# EAGLE design flukso1.3 (EAGLE 5.10)
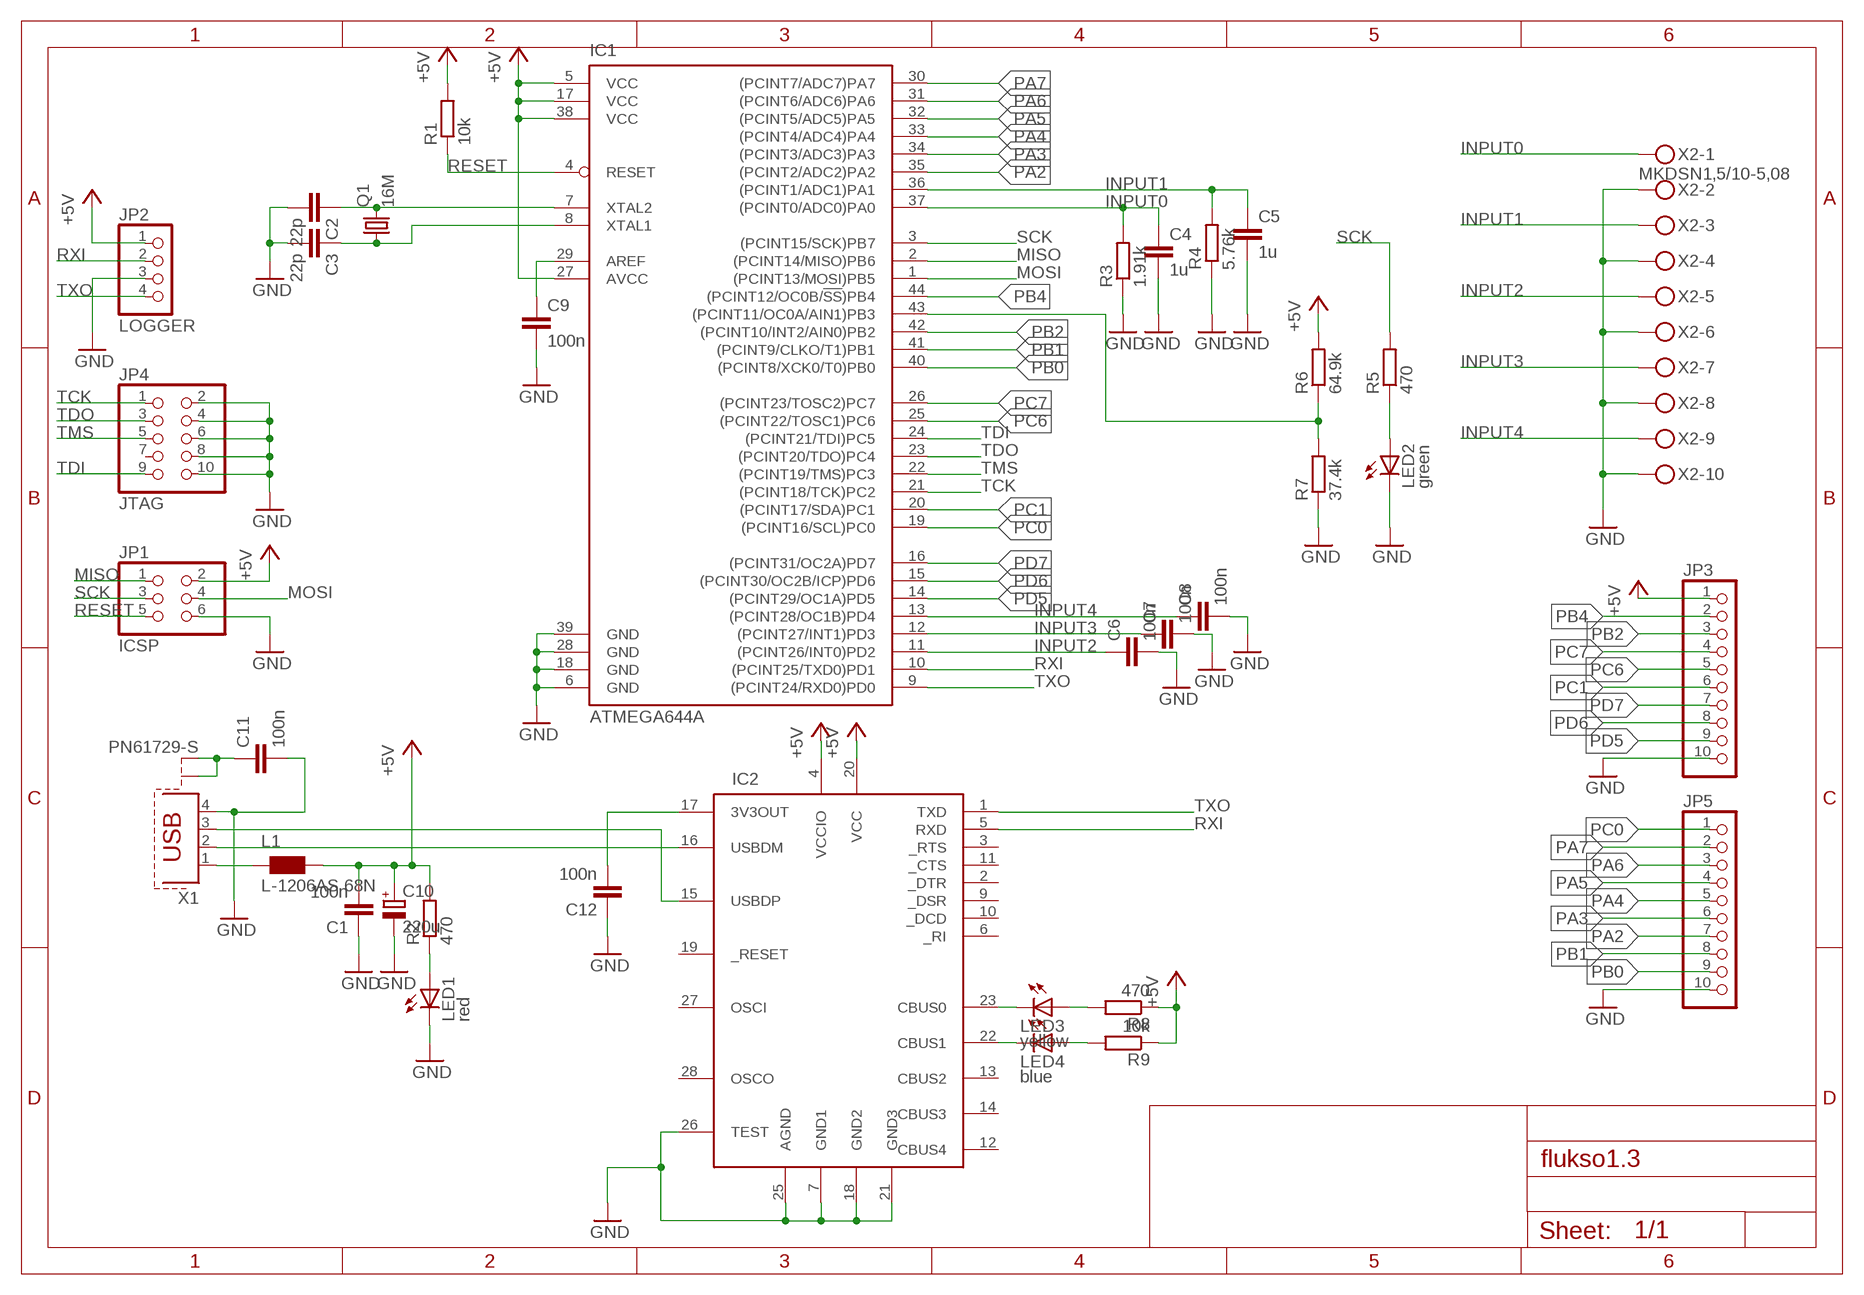
[diagram p0: schematic, sheet 1]

## Parts
C1  100n  C-EUC1206  [C1206]
C2  22p  C-EUC1206  [C1206]
C3  22p  C-EUC1206  [C1206]
C4  1u  C-EUC1206  [C1206]
C5  1u  C-EUC1206  [C1206]
C6  100n  C-EUC1206  [C1206]
C7  100n  C-EUC1206  [C1206]
C8  100n  C-EUC1206  [C1206]
C9  100n  C-EUC1206  [C1206]
C10  220u  CPOL-EU153CLV-0605  [153CLV-0605]
C11  100n  C-EUC1206  [C1206]
C12  100n  C-EUC1206  [C1206]
IC1  ATMEGA644A  [TQFP44]
IC2  FT232RL  [SSOP28DB]
JP1  ICSP  PINHD-2X3  [2X03]
JP2  LOGGER  PINHD-1X4  [1X04]
JP3  PINHD-1X10  [1X10]
JP4  JTAG  PINHD-2X5  [2X05]
JP5  PINHD-1X10  [1X10]
L1  L-1206AS 68N  WE-CBF_1206  [1206]
LED1  red  LEDSMT1206  [1206]
LED2  green  LEDSMT1206  [1206]
LED3  yellow  LEDSMT1206  [1206]
LED4  blue  LEDSMT1206  [1206]
Q1  16M  CRYSTALHC49S  [HC49/S]
R1  10k  R-EU_M1206  [M1206]
R2  470  R-EU_M1206  [M1206]
R3  1.91k  R-EU_M1206  [M1206]
R4  5.76k  R-EU_M1206  [M1206]
R5  470  R-EU_M1206  [M1206]
R6  64.9k  R-EU_M1206  [M1206]
R7  37.4k  R-EU_M1206  [M1206]
R8  470  R-EU_M1206  [M1206]
R9  10k  R-EU_M1206  [M1206]
X1  PN61729-S  [PN61729-S]
X2  MKDSN1,5/10-5,08  [MKDSN1,5/10-5,08]

## Nets
+5V: C1.2 C10.+ IC1.5(VCC) IC1.17(VCC) IC1.27(AVCC) IC1.38(VCC) IC2.4(VCCIO) IC2.20(VCC) JP1.2 JP2.1 JP3.1 L1.2 R1.2 R2.2 R6.2 R8.1 R9.1
GND: C1.1 C2.2 C3.2 C4.2 C5.2 C6.2 C7.2 C8.2 C9.2 C10.- C11.2 C12.1 IC1.6(GND) IC1.18(GND) IC1.28(GND) IC1.39(GND) IC2.7(GND1) IC2.18(GND2) IC2.21(GND3) IC2.25(AGND) IC2.26(TEST) JP1.6 JP2.3 JP3.10 JP4.2 JP4.4 JP4.6 JP4.8 JP4.10 JP5.10 LED1.C LED2.C R3.1 R4.1 R7.1 X1.4 X2.2 X2.4 X2.6 X2.8 X2.10
INPUT0: C4.1 IC1.37((PCINT0/ADC0)PA0) R3.2 X2.1
INPUT1: C5.1 IC1.36((PCINT1/ADC1)PA1) R4.2 X2.3
INPUT2: C6.1 IC1.11((PCINT26/INT0)PD2) X2.5
INPUT3: C7.1 IC1.12((PCINT27/INT1)PD3) X2.7
INPUT4: C8.1 IC1.13((PCINT28/OC1B)PD4) X2.9
MISO: IC1.2((PCINT14/MISO)PB6) JP1.1
MOSI: IC1.1((PCINT13/MOSI)PB5) JP1.4
N$1: L1.1 X1.1
N$2: C11.1 X1.S1 X1.S2
N$3: LED1.A R2.1
N$4: IC2.16(USBDM) X1.2
N$5: IC2.15(USBDP) X1.3
N$6: C12.2 IC2.17(3V3OUT)
N$7: IC1.43((PCINT11/OC0A/AIN1)PB3) R6.1 R7.2
N$8: IC2.23(CBUS0) LED3.C
N$9: LED3.A R8.2
N$10: IC2.22(CBUS1) LED4.C
N$11: LED4.A R9.2
N$12: C2.1 IC1.7(XTAL2) Q1.2
N$13: C3.1 IC1.8(XTAL1) Q1.1
N$14: C9.1 IC1.29(AREF)
N$16: LED2.A R5.1
PA2: IC1.35((PCINT2/ADC2)PA2) JP5.7
PA3: IC1.34((PCINT3/ADC3)PA3) JP5.6
PA4: IC1.33((PCINT4/ADC4)PA4) JP5.5
PA5: IC1.32((PCINT5/ADC5)PA5) JP5.4
PA6: IC1.31((PCINT6/ADC6)PA6) JP5.3
PA7: IC1.30((PCINT7/ADC7)PA7) JP5.2
PB0: IC1.40((PCINT8/XCK0/T0)PB0) JP5.9
PB1: IC1.41((PCINT9/CLKO/T1)PB1) JP5.8
PB2: IC1.42((PCINT10/INT2/AIN0)PB2) JP3.3
PB4: IC1.44((PCINT12/OC0B/!SS!)PB4) JP3.2
PC0: IC1.19((PCINT16/SCL)PC0) JP5.1
PC1: IC1.20((PCINT17/SDA)PC1) JP3.6
PC6: IC1.25((PCINT22/TOSC1)PC6) JP3.5
PC7: IC1.26((PCINT23/TOSC2)PC7) JP3.4
PD5: IC1.14((PCINT29/OC1A)PD5) JP3.9
PD6: IC1.15((PCINT30/OC2B/ICP)PD6) JP3.8
PD7: IC1.16((PCINT31/OC2A)PD7) JP3.7
RESET: IC1.4(RESET) JP1.5 R1.1
RXI: IC1.10((PCINT25/TXD0)PD1) IC2.5(RXD) JP2.2
SCK: IC1.3((PCINT15/SCK)PB7) JP1.3 R5.2
TCK: IC1.21((PCINT18/TCK)PC2) JP4.1
TDI: IC1.24((PCINT21/TDI)PC5) JP4.9
TDO: IC1.23((PCINT20/TDO)PC4) JP4.3
TMS: IC1.22((PCINT19/TMS)PC3) JP4.5
TXO: IC1.9((PCINT24/RXD0)PD0) IC2.1(TXD) JP2.4
Unconnected: IC2.2(_DTR) IC2.3(_RTS) IC2.6(_RI) IC2.9(_DSR) IC2.10(_DCD) IC2.11(_CTS) IC2.12(CBUS4) IC2.13(CBUS2) IC2.14(CBUS3) IC2.19(_RESET) IC2.27(OSCI) IC2.28(OSCO) JP4.7

## Library data of the parts
C1-C9 C11 C12 = resistor:C-EU: CAPACITOR, European symbol
C10 = resistor:CPOL-EU: POLARIZED CAPACITOR, European symbol
IC1 = atmel:ATMEGA644: 8-bit Microcontroller with 64K Bytes In-System Programmable Flash Source: http://www.atmel.com/dyn/resources/prod_documents/doc2593.pdf
IC2 = ftdichip-2:FT232RL: USB UART 4th Generation USB UART (USB <-> Serial) Controller
JP1 = pinhead:PINHD-2X3: PIN HEADER
JP2 = pinhead:PINHD-1X4: PIN HEADER
JP3 JP5 = pinhead:PINHD-1X10: PIN HEADER
JP4 = pinhead:PINHD-2X5: PIN HEADER
L1 = wuerth-elektronik:WE-CBF: SMD EMI Suppression Ferrite Beads - excellent anti-EMI properties - low DCR - impedances till 3000 ohms - rated current up to 6 A
LED1-LED4 = led:LED: LED OSRAM: - CHIPLED LG R971, LG N971, LY N971, LG Q971, LY Q971, LO R971, LY R971 LH N974, LH R974 LS Q976, LO Q976, LY Q976 LO Q996 - Hyper CHIPLED LW Q18S LB Q993, LB Q99A, LB R99A - SideLED LS A670, LO A670, LY A670, LG A670, LP A670 LB A673, LV A673, LT A673, LW A673 LH A674 LY A675 LS A676, LA A676, LO A676, LY A676, LW A676 LS A679, LY A679, LG A679 - Hyper Micro SIDELED® LS Y876, LA Y876, LO Y876, LY Y876 LT Y87S - SmartLED LW L88C, LW L88S LB L89C, LB L89S, LG L890 LS L89K, LO L89K, LY L89K LS L896, LA L896, LO L896, LY L896 - TOPLED LS T670, LO T670, LY T670, LG T670, LP T670 LSG T670, LSP T670, LSY T670, LOP T670, LYG T670 LG T671, LOG T671, LSG T671 LB T673, LV T673, LT T673, LW T673 LH T674 LS T676, LA T676, LO T676, LY T676, LB T676, LH T676, LSB T676, LW T676 LB T67C, LV T67C, LT T67C, LS T67K, LO T67K, LY T67K, LW E67C LS E67B, LA E67B, LO E67B, LY E67B, LB E67C, LV E67C, LT E67C LW T67C LS T679, LY T679, LG T679 LS T770, LO T770, LY T770, LG T770, LP T770 LB T773, LV T773, LT T773, LW T773 LH T774 LS E675, LA E675, LY E675, LS T675 LS T776, LA T776, LO T776, LY T776, LB T776 LHGB T686 LT T68C, LB T68C - Hyper Mini TOPLED® LB M676 - Mini TOPLED Santana® LG M470 LS M47K, LO M47K, LY M47K Source: http://www.osram.convergy.de LUXEON: - LUMILED® LXK2-PW12-R00, LXK2-PW12-S00, LXK2-PW14-U00, LXK2-PW14-V00 LXK2-PM12-R00, LXK2-PM12-S00, LXK2-PM14-U00 LXK2-PE12-Q00, LXK2-PE12-R00, LXK2-PE12-S00, LXK2-PE14-T00, LXK2-PE14-U00 LXK2-PB12-K00, LXK2-PB12-L00, LXK2-PB12-M00, LXK2-PB14-N00, LXK2-PB14-P00, LXK2-PB14-Q00 LXK2-PR12-L00, LXK2-PR12-M00, LXK2-PR14-Q00, LXK2-PR14-R00 LXK2-PD12-Q00, LXK2-PD12-R00, LXK2-PD12-S00 LXK2-PH12-R00, LXK2-PH12-S00 LXK2-PL12-P00, LXK2-PL12-Q00, LXK2-PL12-R00 Source: www.luxeon.com KINGBRIGHT: KA-3528ASYC Source: www.kingbright.com
Q1 = crystal:CRYSTAL: CRYSTAL
R1-R9 = resistor:R-EU_: RESISTOR, European symbol
X1 = con-berg:PN61729-S: BERG USB connector
X2 = con-phoenix-508:MKDSN1,5/10-5,08: MKDSN 1,5/10-5,08 Printklemme Nennstrom: 13,5 A Nennspannung: 250 V Rastermaß: 5,08 mm Polzahl: 10 Anschlussart: Schraubanschluss Montage: Löten Anschlussrichtung Leiter/Platine: 0 ° Artikelnummer: 1729209 Source: http://eshop.phoenixcontact.com .. 1729209.pdf

## Board
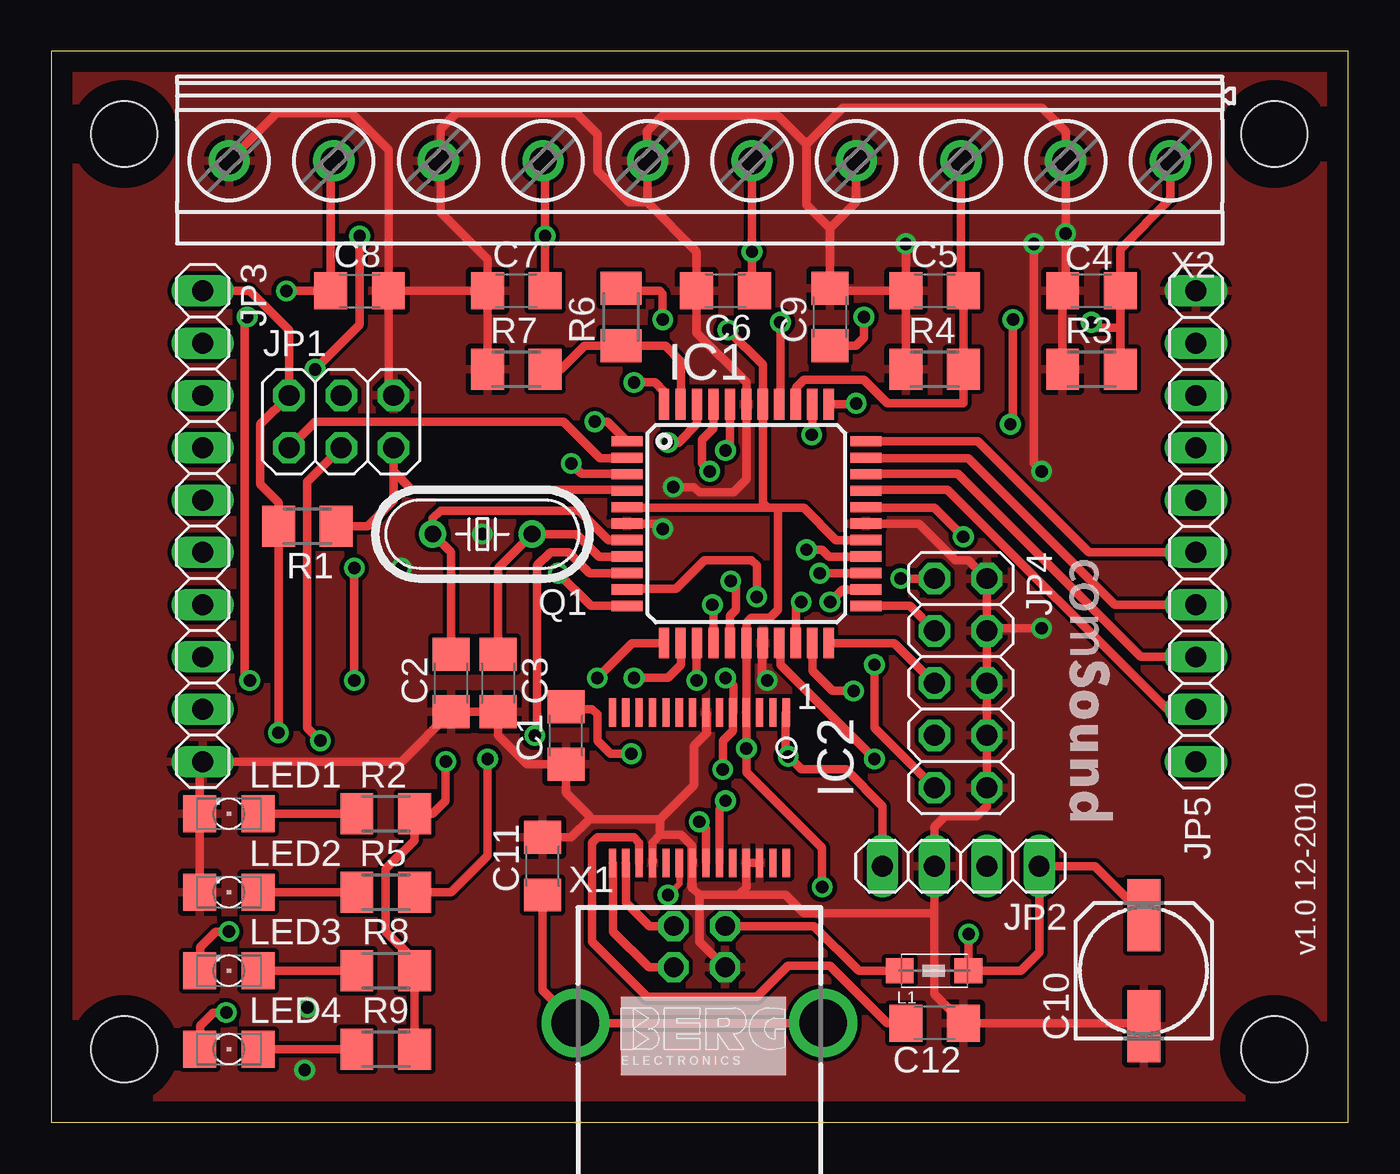
[diagram p1: board, top side]
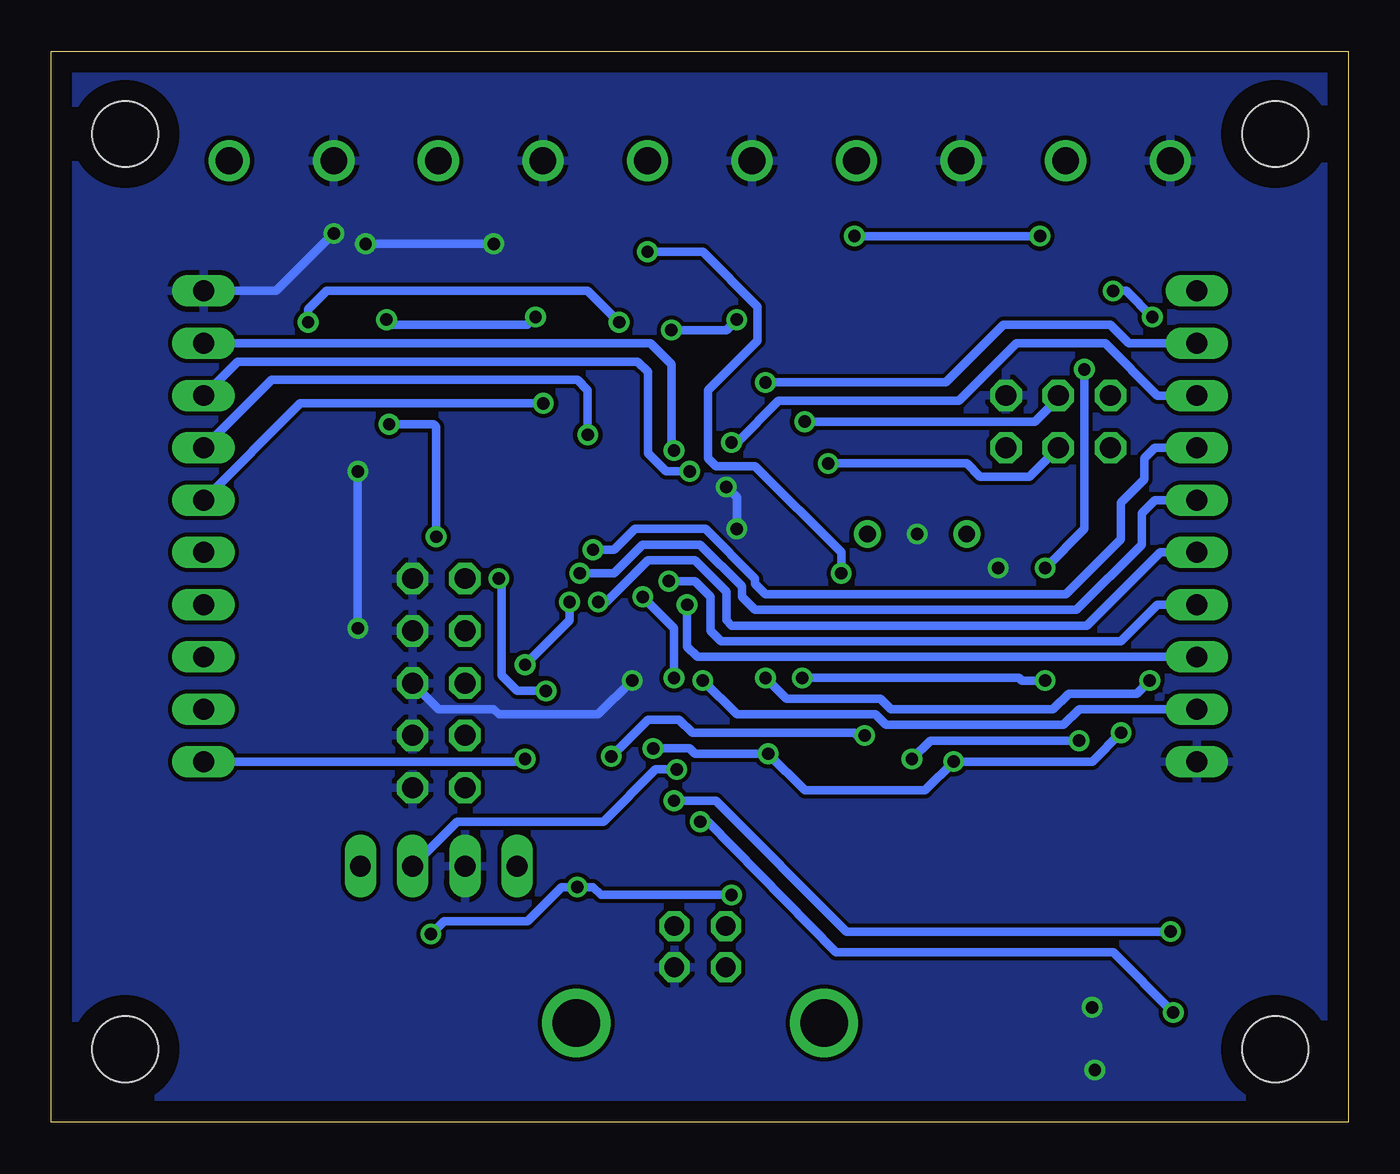
[diagram p2: board, bottom side, seen from below]

Size 63 x 52 mm. Coordinates in mm from the lower left corner, seen from the top.
Outline: 0,0 63,0 63,52 0,52 0,0
Copper layers (1*16): Top 0.035mm / dielectric 1.5mm / Bottom 0.035mm
Design rules "default *": minimum track width 10mil, minimum drill 0.3mm, track to track 8mil, track to pad 8mil, pad to pad 8mil, via to via 8mil, smd to smd 8mil, copper to edge 40mil, drill to drill 8mil, minimum pad ring 10mil, minimum via ring 8mil, stop-mask expansion 4mil, vias tented up to drill 0.61mm, thermal gap 10mil
Holes 3.2 mm at 3.54,47.99 59.42,47.99 3.54,3.54 59.42,3.54

### Footprints (pad centres in the part's own frame; a part is rotated, then mirrored left to right if it is on the bottom)
C1206 = smd 1.6 x 1.8: 1 -1.4,0; 2 1.4,0
153CLV-0605 = smd 3.5 x 1.6: + 2.7,0; - -2.7,0
TQFP44 = smd 1.5 x 0.5: 1 -5.8,4; 2 -5.8,3.2; 3 -5.8,2.4; 4 -5.8,1.6; 5 -5.8,0.8; 6 -5.8,0; 7 -5.8,-0.8; 8 -5.8,-1.6; 9 -5.8,-2.4; 10 -5.8,-3.2; 11 -5.8,-4; 23 5.8,-4; 24 5.8,-3.2; 25 5.8,-2.4; 26 5.8,-1.6; 27 5.8,-0.8; 28 5.8,0; 29 5.8,0.8; 30 5.8,1.6; 31 5.8,2.4; 32 5.8,3.2; 33 5.8,4 | smd 0.5 x 1.5: 12 -4,-5.8; 13 -3.2,-5.8; 14 -2.4,-5.8; 15 -1.6,-5.8; 16 -0.8,-5.8; 17 0,-5.8; 18 0.8,-5.8; 19 1.6,-5.8; 20 2.4,-5.8; 21 3.2,-5.8; 22 4,-5.8; 34 4,5.8; 35 3.2,5.8; 36 2.4,5.8; 37 1.6,5.8; 38 0.8,5.8; 39 0,5.8; 40 -0.8,5.8; 41 -1.6,5.8; 42 -2.4,5.8; 43 -3.2,5.8; 44 -4,5.8
SSOP28DB = smd 0.348 x 1.397: 1 -4.225,-3.656; 2 -3.575,-3.656; 3 -2.925,-3.656; 4 -2.275,-3.656; 5 -1.625,-3.656; 6 -0.975,-3.656; 7 -0.325,-3.656; 8 0.325,-3.656; 9 0.975,-3.656; 10 1.625,-3.656; 11 2.275,-3.656; 12 2.925,-3.656; 13 3.575,-3.656; 14 4.225,-3.656; 15 4.225,3.656; 16 3.575,3.656; 17 2.925,3.656; 18 2.275,3.656; 19 1.625,3.656; 20 0.975,3.656; 21 0.325,3.656; 22 -0.325,3.656; 23 -0.975,3.656; 24 -1.625,3.656; 25 -2.275,3.656; 26 -2.925,3.656; 27 -3.575,3.656; 28 -4.225,3.656
2X03 = drill 1.016 octagon: 1 -2.54,-1.27; 2 -2.54,1.27; 3 0,-1.27; 4 0,1.27; 5 2.54,-1.27; 6 2.54,1.27
1X04 = drill 1.016 long: 1 -3.81,0; 2 -1.27,0; 3 1.27,0; 4 3.81,0
1X10 = drill 1.016 long: 1 -11.43,0; 2 -8.89,0; 3 -6.35,0; 4 -3.81,0; 5 -1.27,0; 6 1.27,0; 7 3.81,0; 8 6.35,0; 9 8.89,0; 10 11.43,0
2X05 = drill 1.016 octagon: 1 -5.08,-1.27; 2 -5.08,1.27; 3 -2.54,-1.27; 4 -2.54,1.27; 5 0,-1.27; 6 0,1.27; 7 2.54,-1.27; 8 2.54,1.27; 9 5.08,-1.27; 10 5.08,1.27
1206 = smd 1.35 x 1.2: 1 -1.7,0; 2 1.65,0
1206' = smd 1.6 x 1.803: A -1.422,0; C 1.422,0
HC49/S = drill 0.813 round: 1 -2.413,0; 2 2.413,0
M1206 = smd 1.6 x 2: 1 -1.4,0; 2 1.4,0
PN61729-S = drill 0.95 octagon: 1 1.25,4.71; 2 -1.25,4.71; 3 -1.25,2.71; 4 1.25,2.71 | drill 2.3 pad 2.9 round: S1 -6.02,0; S2 6.02,0
MKDSN1,5/10-5,08 = drill 1.3 pad 2 round: 1 -22.881,0.025; 2 -17.801,0.025; 3 -12.721,0.025; 4 -7.641,0.025; 5 -2.561,0.025; 6 2.519,0.025; 7 7.599,0.025; 8 12.679,0.025; 9 17.759,0.025; 10 22.839,0.025

### Placement (x,y rotation side)
C1  25,18.78 90 top
C2  19.41,21.32 270 top
C3  21.7,21.32 270 top
C4  50.53,40.37 180 top
C5  42.91,40.37 180 top
C6  32.75,40.37 180 top
C7  22.59,40.37 180 top
C8  14.97,40.37 0 top
C9  37.83,39.1 90 top
C10  53.07,7.35 90 top
C11  23.86,12.43 90 top
C12  42.91,4.81 180 top
IC1  33.77,29.07 0 top
IC2  31.48,16.24 180 top
JP1  14.08,34.02 0 top
JP2  44.18,12.43 180 top
JP3  7.35,28.94 270 top
JP4  44.18,21.32 270 top
JP5  55.61,28.94 90 top
L1  42.91,7.35 0 top
LED1  red  [1206']  8.62,14.97 180 top
LED2  green  [1206']  8.62,11.16 180 top
LED3  yellow  [1206']  8.62,7.35 180 top
LED4  blue  [1206']  8.62,3.54 180 top
Q1  20.94,28.56 180 top
R1  12.43,28.94 180 top
R2  16.24,14.97 0 top
R3  50.53,36.56 0 top
R4  42.91,36.56 0 top
R5  16.24,11.16 0 top
R6  27.67,39.1 90 top
R7  22.59,36.56 0 top
R8  16.24,7.35 180 top
R9  16.24,3.54 180 top
X1  31.48,4.81 0 top
X2  31.48,46.72 180 top

### Tracks (layer width: path | path; a pad name or v marks a point on that pad's centre or on a via)
+5V  (via drill 0.6)
  Top 0.305: v29.96,11.03 30.5,11.58 IC2.20
  Top 0.406: R9.1 R8.1 17.64,7.86 16.24,9.26 16.24,12.3 17.64,13.7 R2.2 18.53,14.97 19.16,15.61 v19.16,17.51 | C10.+ 50.69,12.43 JP2.1 47.99,8.24 47.1,7.35 L1.2 v44.56,9.13 | v37.45,11.41 37.45,13.32 33.77,17 v33.77,18.14 33.77,19.89 IC2.4 IC1.17 33.77,24.24 34.02,24.5 34.91,24.5 35.29,24.88 35.29,29.83 | JP3.1 9.64,40.37 11.54,38.47 JP1.2 10.14,33.89 10.14,30.97 11.03,30.09 R1.2 v11.03,18.91 | C1.2 25.51,20.18 25.64,20.05 26.27,20.05 26.53,19.8 26.53,18.53 27.16,17.89 v28.18,17.89 | IC1.27 38.12,28.27 36.56,29.83 35.29,29.83 | 34.78,29.83 28,29.83 IC1.5 | 35.29,29.83 34.78,29.83 | 34.78,29.83 34.57,30.05 IC1.38 34.57,36.78 v32.88,38.47 | v29.7,38.97 29.7,40.24 29.57,40.37 27.8,40.37 R6.2
  Bottom 0.406: v44.56,9.13 43.93,9.76 39.86,9.76 38.21,11.41 v37.45,11.41 36.69,11.41 36.31,11.03 v29.96,11.03 | v11.03,18.91 12.43,17.51 v19.16,17.51 20.56,16.11 26.4,16.11 v28.18,17.89 31.73,17.89 31.99,18.14 v33.77,18.14 | v32.88,38.47 30.21,38.47 v29.7,38.97
GND  (via drill 0.6)
  Top 0.406: R3.1 C4.2 49.28,40.52 v49.28,43.16 X2.2 49.28,48.1 48.12,49.26 38.47,49.26 36.69,47.48 | 37.83,43.42 39.1,44.69 39.1,46.67 X2.4 | 28.96,44.67 X2.6 28.94,46.72 28.94,48.12 29.7,48.88 35.29,48.88 36.69,47.48 | 28.96,44.67 31.35,42.27 C6.2 31.35,38.34 33.77,35.92 IC1.39 33.77,31.23 33.13,30.59 31.48,30.59 31.23,30.84 v30.21,30.84 | C7.2 C8.2 | C7.2 R7.1 | C7.2 21.19,41.9 18.91,44.18 18.91,46.59 X2.8 18.91,46.8 18.91,48.24 19.67,49.01 25.51,49.01 26.53,47.99 26.53,46.21 28.07,44.67 28.96,44.67 | C8.2 16.37,47.23 14.59,49.01 10.95,49.01 X2.10 | 37.83,43.42 C9.2 37.96,40.37 C5.2 R4.1 v41.51,42.65 v41.51,42.66 | 37.83,43.42 36.69,44.56 36.69,47.48 | LED2.C LED1.C 7.2,17.36 JP3.10 17,17.51 C2.2 C3.2 21.7,18.78 23.1,17.38 C1.1 25,15.99 26.15,14.84 26.15,14.72 | C10.- 52.91,4.81 C12.1 42.91,6.21 42.91,10.14 | 42.91,10.14 JP2.3 42.91,14.34 43.42,14.84 44.94,14.84 45.45,15.35 JP4.10 JP4.8 JP4.6 JP4.4 | IC2.26 IC2.25 33.77,11.41 33.38,11.03 | JP1.6 16.37,35.55 C8.2 | X1.4 31.48,8.77 31.48,11.03 | 31.16,11.36 31.48,11.03 | 31.16,11.36 IC2.21 31.16,13.39 31.1,13.45 | 31.48,11.03 33.38,11.03 | C11.2 23.98,13.95 24.11,13.83 25.26,13.83 26.15,14.72 | 29.19,13.57 29.2,13.56 IC2.18 29.19,12.6 29.19,13.57 | 29.57,13.95 29.19,13.57 | 26.15,14.72 29.57,14.72 | 31.8,18.85 31.23,18.27 31.23,16.37 29.57,14.72 | 31.8,18.85 IC2.7 31.86,19.84 31.86,18.91 31.8,18.85 | JP4.4 JP4.2 44.56,27.29 43.93,27.29 42.15,29.07 IC1.28 | v47.74,42.66 47.74,31.99 v48.12,31.61 | v48.12,23.99 45.58,23.99 JP4.4 | IC1.6 29.45,29.07 v29.7,28.81 | IC1.18 34.53,23.23 34.53,21.7 v34.78,21.45 | 29.57,14.72 29.57,13.95
  Top 0.406: 29.57,13.95 30.59,13.95 31.1,13.45 | 31.1,13.45 31.1,11.41 31.16,11.36 | 33.38,11.03 35.67,11.03 36.56,10.14 42.91,10.14
  Bottom 0.406: JP5.10 52.08,40.37 v49.28,43.16 | v47.74,42.66 v41.51,42.66 | v48.12,23.99 v48.12,31.61 | v29.7,28.81 29.7,30.34 v30.21,30.84 | v34.78,21.45 36.43,19.8 41.26,19.8 41.51,20.05 44.18,20.05 44.94,20.81 45.45,20.81 JP4.6
  other vias: 12.43,5.57 12.3,2.52 17,26.91 20.94,28.56
  pour Top: 0,0 0,51.53 62.71,51.53 62.71,0
  pour Bottom: 0,0 62.71,0 62.71,51.53 0,51.53
INPUT0  (via drill 0.6)
  Top 0.406: X2.1 54.36,44.84 51.93,42.4 C4.1 51.93,38.59 | 51.93,38.59 R3.2 | IC1.37 35.42,34.92 v35.42,38.85 | v50.53,38.85 50.78,38.59 51.93,38.59
  Bottom 0.406: v35.42,38.85 36.94,40.37 49.64,40.37 50.53,39.48 v50.53,38.85
INPUT1
  Top 0.406: X2.3 44.2,40.48 C5.1 R4.2 44.31,34.91 40.62,34.91 39.48,36.05 36.56,36.05 36.17,35.66 IC1.36
INPUT2  (via drill 0.6)
  Top 0.406: C6.1 34.04,40.48 v34.04,42.27 X2.5 | IC1.11 26.21,25.07 v24.62,26.65
  Bottom 0.406: v24.62,26.65 24.62,27.67 28.81,31.86 30.72,31.86 31.1,32.24 31.1,35.54 28.69,37.96 28.69,39.61 31.35,42.27 v34.04,42.27
INPUT3  (via drill 0.6)
  Top 0.406: X2.7 23.88,46.57 23.99,46.47 v23.99,43.04 C7.1 | IC1.12 28.22,23.27 v26.53,21.57 | v14.72,21.45 v14.72,26.91 | v12.81,36.56 14.97,38.72 v14.97,43.04
  Bottom 0.406: v14.72,21.45 15.86,21.45 15.99,21.57 v26.53,21.57 | v14.72,26.91 12.81,28.81 v12.81,36.56 | v14.97,43.04 v23.99,43.04
INPUT4  (via drill 0.6)
  Top 0.406: X2.9 13.57,46.54 C8.1 v11.41,40.37 | v9.51,39.1 9.38,38.85 9.38,21.7 v9.64,21.45 | v28.3,21.57 29.96,21.57 30.59,22.21 30.59,23.24 IC1.13
  Bottom 0.406: v11.41,40.37 10.78,40.37 v9.51,39.1 | v9.64,21.45 10.27,20.81 13.57,20.81 14.34,20.05 22.21,20.05 22.72,20.56 27.29,20.56 v28.3,21.57
MISO
  Top 0.406: IC1.2 27.94,32.24 26.65,32.24 24.88,34.02 12.81,34.02 JP1.1
MOSI  (via drill 0.6)
  Top 0.406: IC1.1 27.01,34.02 v26.4,34.02
  Bottom 0.406: v26.4,34.02 15.22,34.02 14.08,35.16 JP1.4
N$1
  Top 0.406: X1.1 37.06,9.52 39.23,7.35 L1.1
N$2
  Top 0.406: X1.S2 X1.S1 23.86,6.41 C11.1
N$3
  Top 0.406: LED1.A R2.1
N$4
  Top 0.406: X1.2 29.06,9.52 27.92,10.65 27.92,12.56 IC2.16
N$5
  Top 0.406: X1.3 29.02,7.52 27.29,9.26 27.29,12.55 IC2.15
N$6
  Top 0.406: IC2.17 28.56,13.57 28.3,13.83 26.53,13.83 26.27,13.57 26.27,8.75 28.94,6.08 34.27,6.08 35.8,7.6 37.83,7.6 40.62,4.81 C12.2
N$7
  Top 0.406: IC1.43 30.59,34.89 30.59,36.94 29.83,37.7 R6.1 25.89,37.7 24.75,36.56 R7.2
N$8  (via drill 0.6)
  Top 0.406: LED3.C 7.22,7.38 7.22,8.49 7.99,9.26 v8.62,9.26 | v32.75,15.61 32.45,15.18 IC2.23
  Bottom 0.406: v8.62,9.26 24.37,9.26 30.72,15.61 v32.75,15.61
N$9
  Top 0.406: LED3.A R8.2
N$10  (via drill 0.6)
  Top 0.406: LED4.C 7.22,3.56 7.22,4.68 7.86,5.32 v8.49,5.32 | v31.48,14.59 31.8,14.26 IC2.22
  Bottom 0.406: v8.49,5.32 11.41,8.24 24.88,8.24 31.1,14.59 v31.48,14.59
N$11
  Top 0.406: LED4.A R9.2
N$12
  Top 0.406: IC1.7 27.07,28.27 25.64,29.7 18.91,29.7 18.53,29.32 Q1.2 19.41,27.67 C2.1
N$13
  Top 0.406: IC1.8 26.6,27.47 25.51,28.56 Q1.1 21.7,26.91 C3.1
N$14  (via drill 0.6)
  Top 0.406: IC1.29 39.6,29.83 42.91,29.83 v44.31,28.43 | v46.59,33.89 46.72,34.02 v46.72,38.97 | v39.48,39.1 39.48,38.08 39.1,37.7 C9.1
  Bottom 0.406: v44.31,28.43 44.31,33.77 44.43,33.89 v46.59,33.89 | v46.72,38.97 46.72,38.72 39.86,38.72 v39.48,39.1
N$16
  Top 0.406: LED2.A R5.1
PA2  (via drill 0.6)
  Top 0.406: v36.94,33.38 36.97,33.41 IC1.35
  Bottom 0.406: JP5.7 52.31,36.05 37.45,36.05 36.94,35.54 v36.94,33.38
PA3  (via drill 0.6)
  Top 0.406: v39.1,34.91 39.06,34.87 IC1.34
  Bottom 0.406: JP5.6 50.91,34.91 v39.1,34.91
PA4
  Top 0.406: IC1.33 45.01,33.07 50.4,27.67 JP5.5
PA5
  Top 0.406: IC1.32 39.59,32.24 44.56,32.24 51.67,25.13 JP5.4
PA6
  Top 0.406: IC1.31 44.05,31.48 52.94,22.59 JP5.3
PA7
  Top 0.406: IC1.30 39.62,30.72 43.55,30.72 54.21,20.05 JP5.2
PB0  (via drill 0.6)
  Top 0.406: v32.75,32.62 32.97,32.84 IC1.40
  Bottom 0.406: JP5.9 33.89,37.83 32.88,36.81 32.88,32.75 v32.75,32.62
PB1  (via drill 0.6)
  Top 0.406: v31.99,31.61 31.61,31.99 31.61,33.13 32.17,33.69 IC1.41
  Bottom 0.406: JP5.8 53.96,36.94 34.53,36.94 34.02,36.43 34.02,32.5 33.13,31.61 v31.99,31.61
PB2  (via drill 0.6)
  Top 0.406: v29.96,33 30.46,33 31.37,33.91 IC1.42
  Bottom 0.406: JP3.3 9.26,35.29 11.79,37.83 16.11,37.83 18.91,35.04 27.67,35.04 29.7,33 v29.96,33
PB4  (via drill 0.6)
  Top 0.406: v28.3,35.92 29.32,35.92 29.77,35.48 IC1.44
  Bottom 0.406: JP3.2 10.65,37.83 11.54,38.72 16.75,38.72 19.54,35.92 v28.3,35.92
PC0  (via drill 0.6)
  Top 0.406: IC1.19 35.42,23.22 35.42,22.21 v39.99,17.64
  Bottom 0.406: v39.99,17.64 40.12,17.51 JP5.1
PC1  (via drill 0.6)
  Top 0.406: v36.43,25.26 36.17,24.99 IC1.20
  Bottom 0.406: JP3.6 9.13,27.67 12.68,24.11 29.96,24.11 30.21,24.37 30.21,25.77 31.73,27.29 34.02,27.29 36.05,25.26 v36.43,25.26
PC6  (via drill 0.6)
  Top 0.406: v37.32,26.65 37.34,26.67 IC1.25
  Bottom 0.406: JP3.5 9.38,30.21 10.02,29.57 10.02,28.05 13.19,24.88 28.81,24.88 29.45,25.51 29.45,26.02 31.48,28.05 34.27,28.05 35.67,26.65 v37.32,26.65
PC7  (via drill 0.6)
  Top 0.406: v36.69,27.8 37.45,27.8 37.78,27.47 IC1.26
  Bottom 0.406: JP3.4 9.38,32.75 9.89,32.24 9.89,31.23 11.03,30.08 11.03,28.3 13.7,25.64 28.3,25.64 28.81,26.15 28.81,26.4 31.23,28.81 34.66,28.81 35.67,27.8 v36.69,27.8
PD5  (via drill 0.6)
  Top 0.406: v31.35,21.45 31.35,23.25 IC1.14
  Bottom 0.406: JP3.9 13.06,20.05 13.83,19.29 22.46,19.29 22.97,19.8 29.7,19.8 v31.35,21.45
PD6  (via drill 0.6)
  Top 0.406: v32.12,25.13 32.17,25.08 IC1.15
  Bottom 0.406: JP3.8 31.61,22.59 32.12,23.1 v32.12,25.13
PD7  (via drill 0.6)
  Top 0.406: v33,26.27 32.97,26.23 33.13,26.02 33.26,25.89 33.26,24.88 32.97,24.58 IC1.16
  Bottom 0.406: JP3.7 9.26,25.13 11.03,23.35 30.46,23.35 30.97,23.86 30.97,25.51 31.73,26.27 v33,26.27
RESET
  Top 0.406: IC1.4 27.91,30.72 17.51,30.72 16.62,31.61 | 16.62,31.61 16.62,30.21 15.35,28.94 R1.1 | 16.62,31.61 JP1.5
RXI  (via drill 0.6)
  Top 0.406: v32.62,17.13 32.62,18.53 33.1,19.01 IC2.5 33.13,19.9 33.13,21.19 v32.75,21.57 | 27.94,25.89 IC1.10 27.99,25.89 30.34,25.89 31.73,27.29 34.02,27.29 34.27,27.04 v34.27,25.51
  Bottom 0.406: JP2.2 43.29,14.59 36.18,14.59 33.64,17.13 v32.62,17.13 | v32.75,21.57 32.75,23.99 v34.27,25.51
SCK  (via drill 0.6)
  Top 0.406: IC1.3 27.95,31.48 25.77,31.48 v25.26,31.99 | R5.2 19.41,11.16 21.19,12.94 v21.19,17.64 | v13.06,18.53 12.43,19.16 12.43,31.1 JP1.3
  Bottom 0.406: v25.26,31.99 18.53,31.99 17.89,31.35 15.48,31.35 JP1.3 | v21.19,17.64 20.3,18.53 v13.06,18.53
TCK  (via drill 0.6)
  Top 0.406: v41.26,26.4 JP4.1 | v38.97,20.94 37.96,20.94 36.97,21.93 IC1.21
  Bottom 0.406: v41.26,26.4 41.13,26.27 41.13,21.7 40.37,20.94 v38.97,20.94
TDI  (via drill 0.6)
  Top 0.406: JP4.9 39.99,19.16 v39.99,22.21 | v37.83,25.26 38.44,25.87 IC1.24
  Bottom 0.406: v39.99,22.21 37.83,24.37 v37.83,25.26
TDO
  Top 0.406: JP4.3 41.7,25.07 IC1.23
TMS
  Top 0.406: JP4.5 40.96,23.27 IC1.22
TXO  (via drill 0.6)
  Top 0.406: JP2.4 40.37,15.35 38.59,17.13 36.43,17.13 v35.8,17.76 35.67,17.89 35.67,19.86 IC2.1 | IC1.9 26.13,26.67 25.13,27.67 24.24,27.67 23.61,27.04 23.61,19.16 23.48,19.03 v23.48,18.78
  Bottom 0.406: v23.48,18.78 23.86,18.78 23.99,18.91 31.86,18.91 32.5,19.54 34.02,19.54 v35.8,17.76

### Text on the board
tNames: v1.0 12-2010
tStop: from Fraunhofer ITWM with love